# EAGLE design balancing robot pcb (EAGLE 9.6.1)
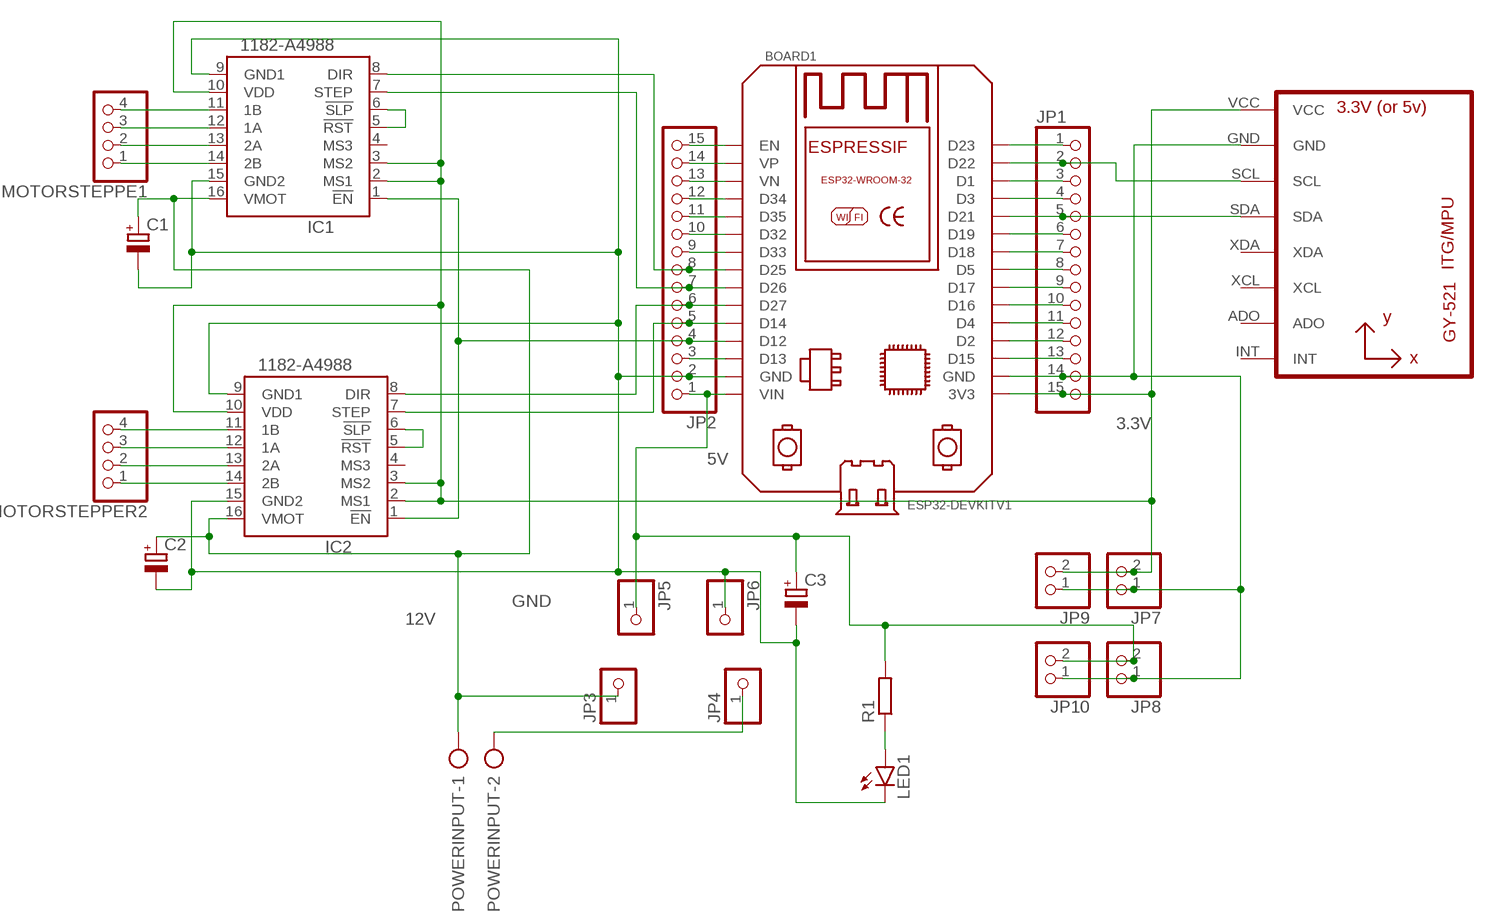
[diagram p0: schematic, sheet 1]

## Parts
BOARD1  ESP32DEVKITV1  [ESP32-DEVKITV1]
C1  CPOL-EUE3.5-8  [E3,5-8]
C2  CPOL-EUE3.5-8  [E3,5-8]
C3  CPOL-EUE3.5-8  [E3,5-8]
IC1  1182-A4988  [A4988]
IC2  1182-A4988  [A4988]
JP1  PINHD-1X15  [1X15]
JP2  PINHD-1X15  [1X15]
JP3  PINHD-1X1  [1X01]
JP4  PINHD-1X1  [1X01]
JP5  PINHD-1X1  [1X01]
JP6  PINHD-1X1  [1X01]
JP7  PINHD-1X2  [1X02]
JP8  PINHD-1X2  [1X02]
JP9  PINHD-1X2  [1X02]
JP10  PINHD-1X2  [1X02]
LED1  LED5MM  [LED5MM]
MOTORSTEPPE1  PINHD-1X4  [1X04]
MOTORSTEPPER2  PINHD-1X4  [1X04]
POWERINPUT  AK500/2-H  [AK500/2-H]
R1  R-EU_0204/7  [0204/7]
U1  GY-521MPU6050  [GY-521]

## Nets
3.3V: BOARD1.3V3 IC1.2(MS1) IC1.3(MS2) IC1.10(VDD) IC2.2(MS1) IC2.3(MS2) IC2.10(VDD) JP1.15 JP7.2 JP9.2 U1.VCC
5V: BOARD1.VIN C3.+ JP2.1 JP5.1 JP8.2 JP10.2 R1.2
12V: C1.+ C2.+ IC1.16(VMOT) IC2.16(VMOT) JP3.1 POWERINPUT.1
GND: BOARD1.GND C1.- C2.- C3.- IC1.9(GND1) IC1.15(GND2) IC2.9(GND1) IC2.15(GND2) JP2.2 JP6.1 LED1.K(C)
N$1: BOARD1.D25 IC1.8(DIR) JP2.8
N$2: BOARD1.D26 IC1.7(STEP) JP2.7
N$3: BOARD1.D27 IC2.8(DIR) JP2.6
N$4: BOARD1.D14 IC2.7(STEP) JP2.5
N$5: IC1.14(2B) MOTORSTEPPE1.1
N$6: IC1.13(2A) MOTORSTEPPE1.2
N$7: IC1.12(1A) MOTORSTEPPE1.3
N$8: IC1.11(1B) MOTORSTEPPE1.4
N$9: IC2.14(2B) MOTORSTEPPER2.1
N$10: IC2.13(2A) MOTORSTEPPER2.2
N$11: IC2.12(1A) MOTORSTEPPER2.3
N$12: IC2.11(1B) MOTORSTEPPER2.4
N$13: BOARD1.D23 JP1.1
N$14: BOARD1.D22 JP1.2 U1.SCL
N$15: BOARD1.D1 JP1.3
N$16: BOARD1.D3 JP1.4
N$17: BOARD1.D21 JP1.5 U1.SDA
N$18: BOARD1.D19 JP1.6
N$19: BOARD1.D18 JP1.7
N$20: BOARD1.D5 JP1.8
N$21: BOARD1.D17 JP1.9
N$22: BOARD1.D16 JP1.10
N$23: BOARD1.D4 JP1.11
N$24: BOARD1.D2 JP1.12
N$25: BOARD1.D15 JP1.13
N$26: BOARD1.GND@1(GND) JP1.14 JP7.1 JP8.1 JP9.1 JP10.1 U1.GND
N$27: JP4.1 POWERINPUT.2
N$28: LED1.A R1.1
N$30: BOARD1.D13 JP2.3
N$31: BOARD1.D12 IC1.1(!EN) IC2.1(!EN) JP2.4
N$32: BOARD1.D33 JP2.9
N$33: BOARD1.D32 JP2.10
N$34: BOARD1.D35 JP2.11
N$35: BOARD1.D34 JP2.12
N$36: BOARD1.VN JP2.13
N$37: BOARD1.VP JP2.14
N$38: BOARD1.EN JP2.15
N$39: IC1.5(!RST) IC1.6(!SLP)
N$40: IC2.5(!RST) IC2.6(!SLP)
Unconnected: IC1.4(MS3) IC2.4(MS3) U1.ADO U1.INT U1.XCL U1.XDA

## Library data of the parts
BOARD1 = ESP32-DEVKITV1:ESP32DEVKITV1: https://github.com/shridattdudhat
C1-C3 = rcl:CPOL-EU: POLARIZED CAPACITOR, European symbol; SPICEPREFIX: C
IC1 IC2 = pololu-stepper-driver:1182-A4988: A4988 Stepper Motor Driver Carrier #1182 A4988 Stepper Motor Driver Carrier <https://www.pololu.com/product/1182> in Japan, Suzaku Lab. Ltd. <https://suzakugiken.jp/> #1182 A4988ステッピングモータドライバ <https://szc.jp/po1182>
JP1 JP2 = pinhead:PINHD-1X15: PIN HEADER
JP3-JP6 = pinhead:PINHD-1X1: PIN HEADER
JP7-JP10 = pinhead:PINHD-1X2: PIN HEADER
LED1 = led:LED: LED OSRAM: - CHIPLED LG R971, LG N971, LY N971, LG Q971, LY Q971, LO R971, LY R971 LH N974, LH R974 LS Q976, LO Q976, LY Q976 LO Q996 - Hyper CHIPLED LW Q18S LB Q993, LB Q99A, LB R99A - SideLED LS A670, LO A670, LY A670, LG A670, LP A670 LB A673, LV A673, LT A673, LW A673 LH A674 LY A675 LS A676, LA A676, LO A676, LY A676, LW A676 LS A679, LY A679, LG A679 - Hyper Micro SIDELED® LS Y876, LA Y876, LO Y876, LY Y876 LT Y87S - SmartLED LW L88C, LW L88S LB L89C, LB L89S, LG L890 LS L89K, LO L89K, LY L89K LS L896, LA L896, LO L896, LY L896 - TOPLED LS T670, LO T670, LY T670, LG T670, LP T670 LSG T670, LSP T670, LSY T670, LOP T670, LYG T670 LG T671, LOG T671, LSG T671 LB T673, LV T673, LT T673, LW T673 LH T674 LS T676, LA T676, LO T676, LY T676, LB T676, LH T676, LSB T676, LW T676 LB T67C, LV T67C, LT T67C, LS T67K, LO T67K, LY T67K, LW E67C LS E67B, LA E67B, LO E67B, LY E67B, LB E67C, LV E67C, LT E67C LW T67C LS T679, LY T679, LG T679 LS T770, LO T770, LY T770, LG T770, LP T770 LB T773, LV T773, LT T773, LW T773 LH T774 LS E675, LA E675, LY E675, LS T675 LS T776, LA T776, LO T776, LY T776, LB T776 LHGB T686 LT T68C, LB T68C - Hyper Mini TOPLED® LB M676 - Mini TOPLED Santana® LG M470 LS M47K, LO M47K, LY M47K Source: http://www.osram.convergy.de LUXEON: - LUMILED® LXK2-PW12-R00, LXK2-PW12-S00, LXK2-PW14-U00, LXK2-PW14-V00 LXK2-PM12-R00, LXK2-PM12-S00, LXK2-PM14-U00 LXK2-PE12-Q00, LXK2-PE12-R00, LXK2-PE12-S00, LXK2-PE14-T00, LXK2-PE14-U00 LXK2-PB12-K00, LXK2-PB12-L00, LXK2-PB12-M00, LXK2-PB14-N00, LXK2-PB14-P00, LXK2-PB14-Q00 LXK2-PR12-L00, LXK2-PR12-M00, LXK2-PR14-Q00, LXK2-PR14-R00 LXK2-PD12-Q00, LXK2-PD12-R00, LXK2-PD12-S00 LXK2-PH12-R00, LXK2-PH12-S00 LXK2-PL12-P00, LXK2-PL12-Q00, LXK2-PL12-R00 Source: www.luxeon.com KINGBRIGHT: KA-3528ASYC Source: www.kingbright.com
MOTORSTEPPE1 MOTORSTEPPER2 = pinhead:PINHD-1X4: PIN HEADER
POWERINPUT = con-ptr500:AK500/2-H: CONNECTOR Aug. 2004 / PTR Meßtechnik: Die Bezeichnung der Serie AK505 wurde geändert. Es handelt sich hierbei um AK500 in horizontaler Ausführung.; OC_FARNELL: unknown; OC_NEWARK: unknown
R1 = rcl:R-EU_: RESISTOR, European symbol; SPICEPREFIX: R
U1 = gy-521:GY-521

## Board
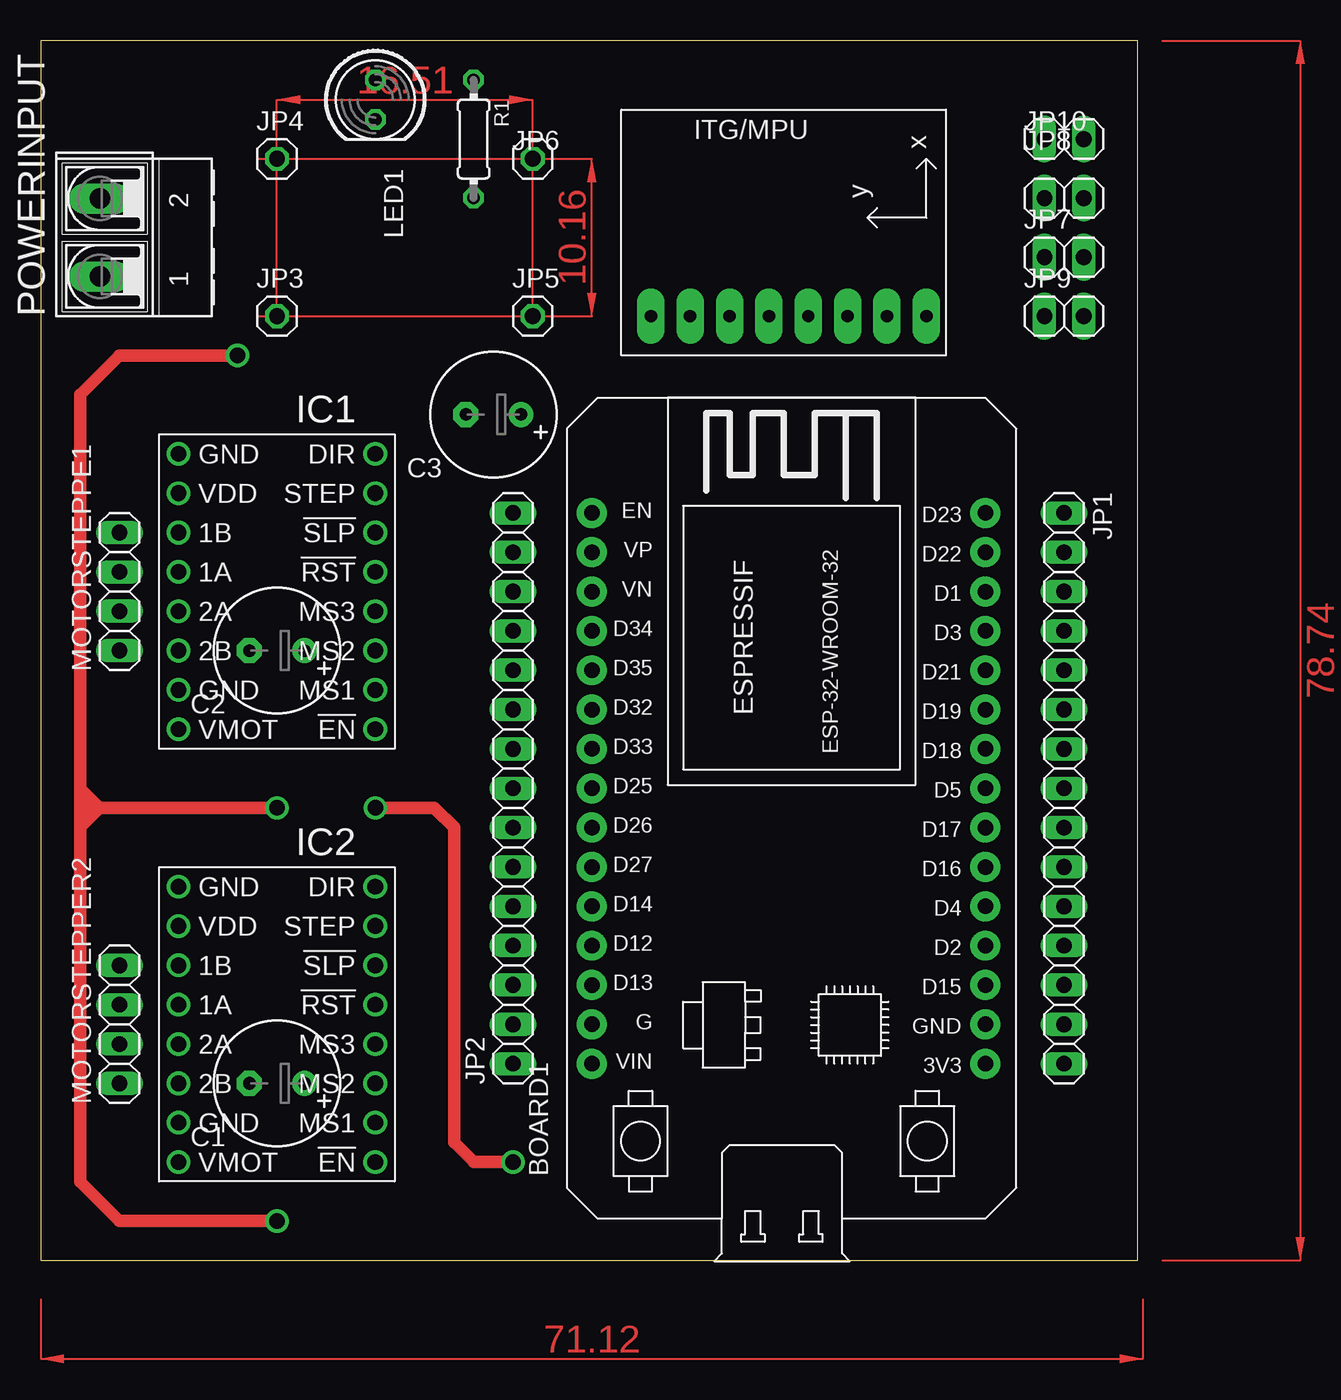
[diagram p1: board, top side]
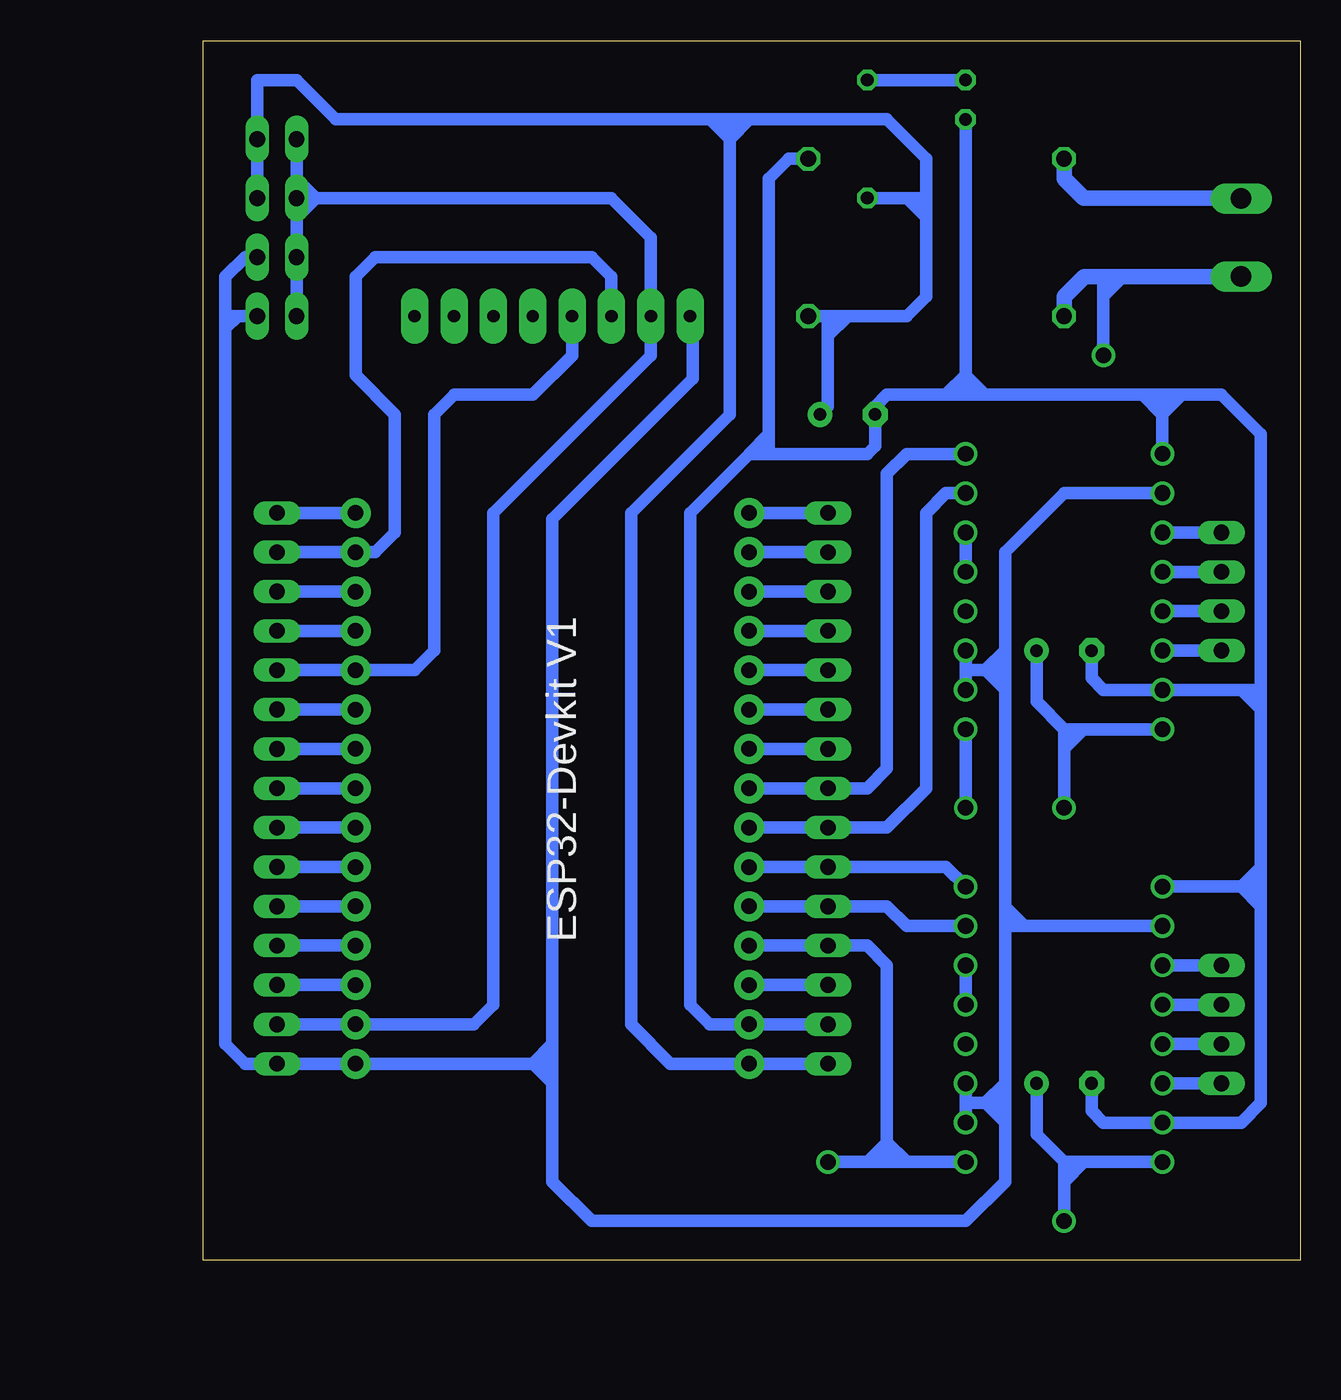
[diagram p2: board, bottom side, seen from below]

Size 70.79 x 78.73 mm. Coordinates in mm from the lower left corner, seen from the top.
Outline: 0,0 70.79,0 70.79,78.73 0,78.73 0,0
Copper layers (1*16): Top 0.035mm / dielectric 1.5mm / Bottom 0.035mm
Design rules "default": minimum track width 6mil, minimum drill 0.35mm, track to track 6mil, track to pad 6mil, pad to pad 6mil, via to via 6mil, smd to smd 6mil, copper to edge 40mil, drill to drill 6mil, minimum pad ring 10mil, minimum via ring 8mil, stop-mask expansion 4mil, vias tented up to drill 0mil, thermal gap 10mil

### Footprints (pad centres in the part's own frame; a part is rotated, then mirrored left to right if it is on the bottom)
ESP32-DEVKITV1 = drill 1 pad 1.93: 3V3 0,0; D1 30.48,0; D2 7.62,0; D3 27.94,0; D4 10.16,0; D5 17.78,0; D12 7.62,25.4; D13 5.08,25.4; D14 10.16,25.4; D15 5.08,0; D16 12.7,0; D17 15.24,0; D18 20.32,0; D19 22.86,0; D21 25.4,0; D22 33.02,0; D23 35.56,0; D25 17.78,25.4; D26 15.24,25.4; D27 12.7,25.4; D32 22.86,25.4; D33 20.32,25.4; D34 27.94,25.4; D35 25.4,25.4; EN 35.56,25.4; GND 2.54,25.4; GND@1 2.54,0; VIN 0,25.4; VN 30.48,25.4; VP 33.02,25.4
E3,5-8 = drill 0.813 pad 1.6: + -1.778,0 | drill 0.813 pad 1.6 octagon: - 1.778,0
A4988 = drill 1.016: 1 -6.35,8.89; 2 -6.35,6.35; 3 -6.35,3.81; 4 -6.35,1.27; 5 -6.35,-1.27; 6 -6.35,-3.81; 7 -6.35,-6.35; 8 -6.35,-8.89; 9 6.35,-8.89; 10 6.35,-6.35; 11 6.35,-3.81; 12 6.35,-1.27; 13 6.35,1.27; 14 6.35,3.81; 15 6.35,6.35; 16 6.35,8.89
1X15 = drill 1.016 long: 1 -17.78,0; 2 -15.24,0; 3 -12.7,0; 4 -10.16,0; 5 -7.62,0; 6 -5.08,0; 7 -2.54,0; 8 0,0; 9 2.54,0; 10 5.08,0; 11 7.62,0; 12 10.16,0; 13 12.7,0; 14 15.24,0; 15 17.78,0
1X01 = drill 1.016 octagon: 1 0,0
1X02 = drill 1.016 long: 1 -1.27,0; 2 1.27,0
LED5MM = drill 0.813 octagon: A -1.27,0; K 1.27,0
1X04 = drill 1.016 long: 1 -3.81,0; 2 -1.27,0; 3 1.27,0; 4 3.81,0
AK500/2-H = drill 1.321 long: 1 -2.515,0; 2 2.515,0
0204/7 = drill 0.813 octagon: 1 -3.81,0; 2 3.81,0
GY-521 = drill 0.8 pad 1.778 long: ADO -8.89,-6.35; GND -8.89,6.35; INT -8.89,-8.89; SCL -8.89,3.81; SDA -8.89,1.27; VCC -8.89,8.89; XCL -8.89,-3.81; XDA -8.89,-1.27

### Placement (x,y rotation side)
BOARD1  60.96,12.7 90 top
C1  15.24,11.43 180 top
C2  15.24,39.37 180 top
C3  29.21,54.61 180 top
IC1  15.24,43.18 180 top
IC2  15.24,15.24 180 top
JP1  66.04,30.48 270 top
JP2  30.48,30.48 90 top
JP3  15.24,60.96 0 top
JP4  15.24,71.12 0 top
JP5  31.75,60.96 0 top
JP6  31.75,71.12 0 top
JP7  66.04,64.77 0 top
JP8  66.04,68.58 0 top
JP9  66.04,60.96 0 top
JP10  66.04,72.39 0 top
LED1  21.59,74.93 270 top
MOTORSTEPPE1  5.08,43.18 90 top
MOTORSTEPPER2  5.08,15.24 90 top
POWERINPUT  3.81,66.04 90 top
R1  27.94,72.39 270 top
U1  48.26,69.85 90 top

### Tracks (layer width: path | path; a pad name or v marks a point on that pad's centre or on a via)
3.3V
  Bottom 0.813: IC1.10 15.24,49.53 19.05,45.72 19.05,39.37 | IC2.3 21.59,10.16 | 21.59,10.16 IC2.2 | 19.05,10.16 19.05,11.43 | 19.05,11.43 19.05,21.59 | 21.59,10.16 20.32,10.16 | 19.05,10.16 20.32,10.16 | U1.VCC 39.19,60.78 39.19,56.93 48.26,47.86 48.26,13.97 | 48.26,13.97 48.26,12.7 | 49.53,12.7 BOARD1.3V3 JP1.15 68.1,12.7 69.37,13.97 69.37,60.17 | 49.53,12.7 48.26,12.7 | 48.26,11.43 48.26,5.08 45.72,2.54 21.59,2.54 19.05,5.08 19.05,8.89 | 48.26,11.43 48.26,12.7 | 69.37,60.17 69.37,60.96 | 69.37,60.96 69.37,63.5 68.1,64.77 JP7.2 | 19.05,21.59 17.78,21.59 | 17.78,21.59 IC2.10 | 19.05,39.37 19.05,38.1 | 19.05,38.1 19.05,36.83 | 19.05,36.83 19.05,22.86 | 19.05,22.86 19.05,21.59 | 17.78,21.59 19.05,22.86 | 49.53,12.7 48.26,13.97 | 48.26,11.43 49.53,12.7 | IC1.2 21.59,38.1 | 21.59,38.1 IC1.3 | 21.59,38.1 20.32,38.1 | 19.05,38.1 20.32,38.1 | 20.32,38.1 19.05,39.37 | 20.32,38.1 19.05,36.83 | 20.32,10.16 19.05,11.43 | 19.05,10.16 19.05,8.89 | 20.32,10.16 19.05,8.89 | JP9.2 68.58,60.96 | 68.58,60.96 69.37,60.96 | 68.58,60.96 69.37,60.17
5V
  Bottom 0.813: JP2.1 BOARD1.VIN 40.64,12.7 43.18,15.24 43.18,48.26 36.83,54.61 36.83,72.39 | 24.13,67.31 24.13,62.23 25.4,60.96 29.21,60.96 | 24.13,67.31 24.13,68.58 | 24.13,68.58 24.13,71.12 26.67,73.66 35.56,73.66 | 29.21,60.96 30.48,60.96 | 30.48,60.96 JP5.1 | 38.1,73.66 62.23,73.66 64.77,76.2 67.31,76.2 JP10.2 JP8.2 | 38.1,73.66 36.83,72.39 | 35.56,73.66 36.83,73.66 | 36.83,73.66 38.1,73.66 | 36.83,72.39 35.56,73.66 | 36.83,72.39 36.83,73.66 | C3.+ 30.48,55.12 30.48,59.69 | 30.48,59.69 30.48,60.96 | 30.48,59.69 29.21,60.96 | R1.2 25.4,68.58 | 25.4,68.58 24.13,68.58 | 25.4,68.58 24.13,67.31
12V  (via drill 1)
  Top 0.813: v15.24,2.54 5.08,2.54 2.54,5.08 2.54,27.94 | 2.54,27.94 2.54,29.21 | 2.54,29.21 2.54,30.48 | 2.54,30.48 2.54,55.88 5.08,58.42 v12.7,58.42 | v15.24,29.21 3.81,29.21 | 2.54,29.21 3.81,29.21 | 3.81,29.21 2.54,30.48 | 3.81,29.21 2.54,27.94
  Bottom 0.813: IC2.16 13.97,6.35 | 13.97,6.35 15.24,6.35 | IC1.16 13.97,34.29 | 13.97,34.29 15.24,34.29 | 15.24,34.29 17.02,36.07 C2.+ | 15.24,6.35 17.02,8.13 C1.+ | 15.24,34.29 15.24,33.02 | 15.24,33.02 v15.24,29.21 | 15.24,33.02 13.97,34.29 | 15.24,6.35 15.24,5.08 | 15.24,5.08 v15.24,2.54 | 12.7,63.52 12.7,62.23 | 12.7,62.23 v12.7,58.42 | 15.24,5.08 13.97,6.35 | 12.7,62.23 11.43,63.5 11.43,63.52
  Bottom 1.016: JP3.1 15.24,62.23 13.94,63.52 12.7,63.52 11.43,63.52 POWERINPUT.1
GND
  Bottom 0.813: JP2.2 BOARD1.GND 38.1,15.24 39.37,16.51 39.37,48.26 35.56,52.07 | 2.54,36.83 2.54,35.56 | 2.54,35.56 2.54,25.4 | 2.54,25.4 2.54,24.13 | IC2.9 3.81,24.13 | 2.54,24.13 3.81,24.13 | C1.- 13.46,9.65 12.7,8.89 IC2.15 3.81,8.89 2.54,10.16 2.54,22.86 | C2.- 13.46,37.59 12.7,36.83 IC1.15 3.81,36.83 | JP6.1 33.02,71.12 34.29,69.85 34.29,53.34 | 34.29,53.34 34.29,52.07 | 2.54,22.86 2.54,24.13 | 3.81,24.13 2.54,25.4 | 3.81,24.13 2.54,22.86 | 3.81,36.83 2.54,36.83 | 2.54,35.56 3.81,36.83 | 7.62,55.88 5.08,55.88 2.54,53.34 2.54,36.83 | 7.62,55.88 8.89,55.88 | 8.89,55.88 10.16,55.88 | 35.56,52.07 34.29,53.34 | IC1.9 8.89,54.61 | 8.89,55.88 8.89,54.61 | 8.89,54.61 10.16,55.88 | 8.89,54.61 7.62,55.88 | 35.56,52.07 34.29,52.07 | 34.29,52.07 27.94,52.07 27.43,52.58 C3.- 27.43,55.12 26.67,55.88 22.86,55.88 | 10.16,55.88 20.32,55.88 | 20.32,55.88 21.59,55.88 | 21.59,55.88 22.86,55.88 | LED1.K 21.59,57.15 | 21.59,55.88 21.59,57.15 | 21.59,57.15 20.32,55.88 | 21.59,57.15 22.86,55.88
N$1
  Bottom 0.813: BOARD1.D25 JP2.8 27.94,30.48 26.67,31.75 26.67,50.8 25.4,52.07 IC1.8
N$2
  Bottom 0.813: BOARD1.D26 JP2.7 26.67,27.94 24.13,30.48 24.13,48.26 22.86,49.53 IC1.7
N$3
  Bottom 0.813: BOARD1.D27 JP2.6 22.86,25.4 IC2.8
N$4
  Bottom 0.813: BOARD1.D14 JP2.5 26.67,22.86 25.4,21.59 IC2.7
N$5
  Bottom 0.813: MOTORSTEPPE1.1 IC1.14
N$6
  Bottom 0.813: MOTORSTEPPE1.2 IC1.13
N$7
  Bottom 0.813: IC1.12 MOTORSTEPPE1.3
N$8
  Bottom 0.813: MOTORSTEPPE1.4 IC1.11
N$9
  Bottom 0.813: MOTORSTEPPER2.1 IC2.14
N$10
  Bottom 0.813: MOTORSTEPPER2.2 IC2.13
N$11
  Bottom 0.813: MOTORSTEPPER2.3 IC2.12
N$12
  Bottom 0.813: MOTORSTEPPER2.4 IC2.11
N$13
  Bottom 0.813: JP1.1 BOARD1.D23
N$14
  Bottom 0.813: JP1.2 BOARD1.D22 59.69,45.72 58.42,46.99 58.42,54.61 60.96,57.15 60.96,63.5 59.69,64.77 45.72,64.77 44.45,63.5 U1.SCL
N$15
  Bottom 0.813: JP1.3 BOARD1.D1
N$16
  Bottom 0.813: JP1.4 BOARD1.D3
N$17
  Bottom 0.813: JP1.5 BOARD1.D21 57.15,38.1 55.88,39.37 55.88,54.61 54.61,55.88 49.53,55.88 46.99,58.42 U1.SDA
N$18
  Bottom 0.813: JP1.6 BOARD1.D19
N$19
  Bottom 0.813: JP1.7 BOARD1.D18
N$20
  Bottom 0.813: JP1.8 BOARD1.D5
N$21
  Bottom 0.813: JP1.9 BOARD1.D17
N$22
  Bottom 0.813: BOARD1.D16 JP1.10
N$23
  Bottom 0.813: JP1.11 BOARD1.D4
N$24
  Bottom 0.813: BOARD1.D2 JP1.12
N$25
  Bottom 0.813: JP1.13 BOARD1.D15
N$26
  Bottom 0.813: JP1.14 BOARD1.GND@1 53.34,15.24 52.07,16.51 52.07,48.26 41.91,58.42 U1.GND 41.91,66.04 44.45,68.58 63.5,68.58 | 64.77,67.31 JP7.1 JP9.1 | 64.77,67.31 JP8.1 | JP10.1 64.77,69.85 | 64.77,69.85 JP8.1 | JP8.1 63.5,68.58 | 63.5,68.58 64.77,67.31 | 63.5,68.58 64.77,69.85
N$27
  Bottom 1.016: POWERINPUT.2 3.83,68.58 13.97,68.58 15.24,69.85 JP4.1
N$28
  Bottom 0.813: R1.1 LED1.A
N$30
  Bottom 0.813: JP2.3 BOARD1.D13
N$31  (via drill 1)
  Top 0.813: v30.48,6.35 27.94,6.35 26.67,7.62 26.67,27.94 25.4,29.21 v21.59,29.21
  Bottom 0.813: BOARD1.D12 JP2.4 27.94,20.32 26.67,19.05 26.67,7.62 | IC2.1 25.4,6.35 | 25.4,6.35 26.67,6.35 | 26.67,6.35 26.67,7.62 | IC1.1 v21.59,29.21 | 26.67,6.35 27.94,6.35 | 27.94,6.35 v30.48,6.35 | 27.94,6.35 26.67,7.62 | 26.67,7.62 25.4,6.35
N$32
  Bottom 0.813: BOARD1.D33 JP2.9
N$33
  Bottom 0.813: BOARD1.D32 JP2.10
N$34
  Bottom 0.813: JP2.11 BOARD1.D35
N$35
  Bottom 0.813: BOARD1.D34 JP2.12
N$36
  Bottom 0.813: JP2.13 BOARD1.VN
N$37
  Bottom 0.813: BOARD1.VP JP2.14
N$38
  Bottom 0.813: JP2.15 BOARD1.EN
N$39
  Bottom 0.813: IC1.5 IC1.6
N$40
  Bottom 0.813: IC2.5 IC2.6
(copper drawn outside any net)
  shapes: Top area x4